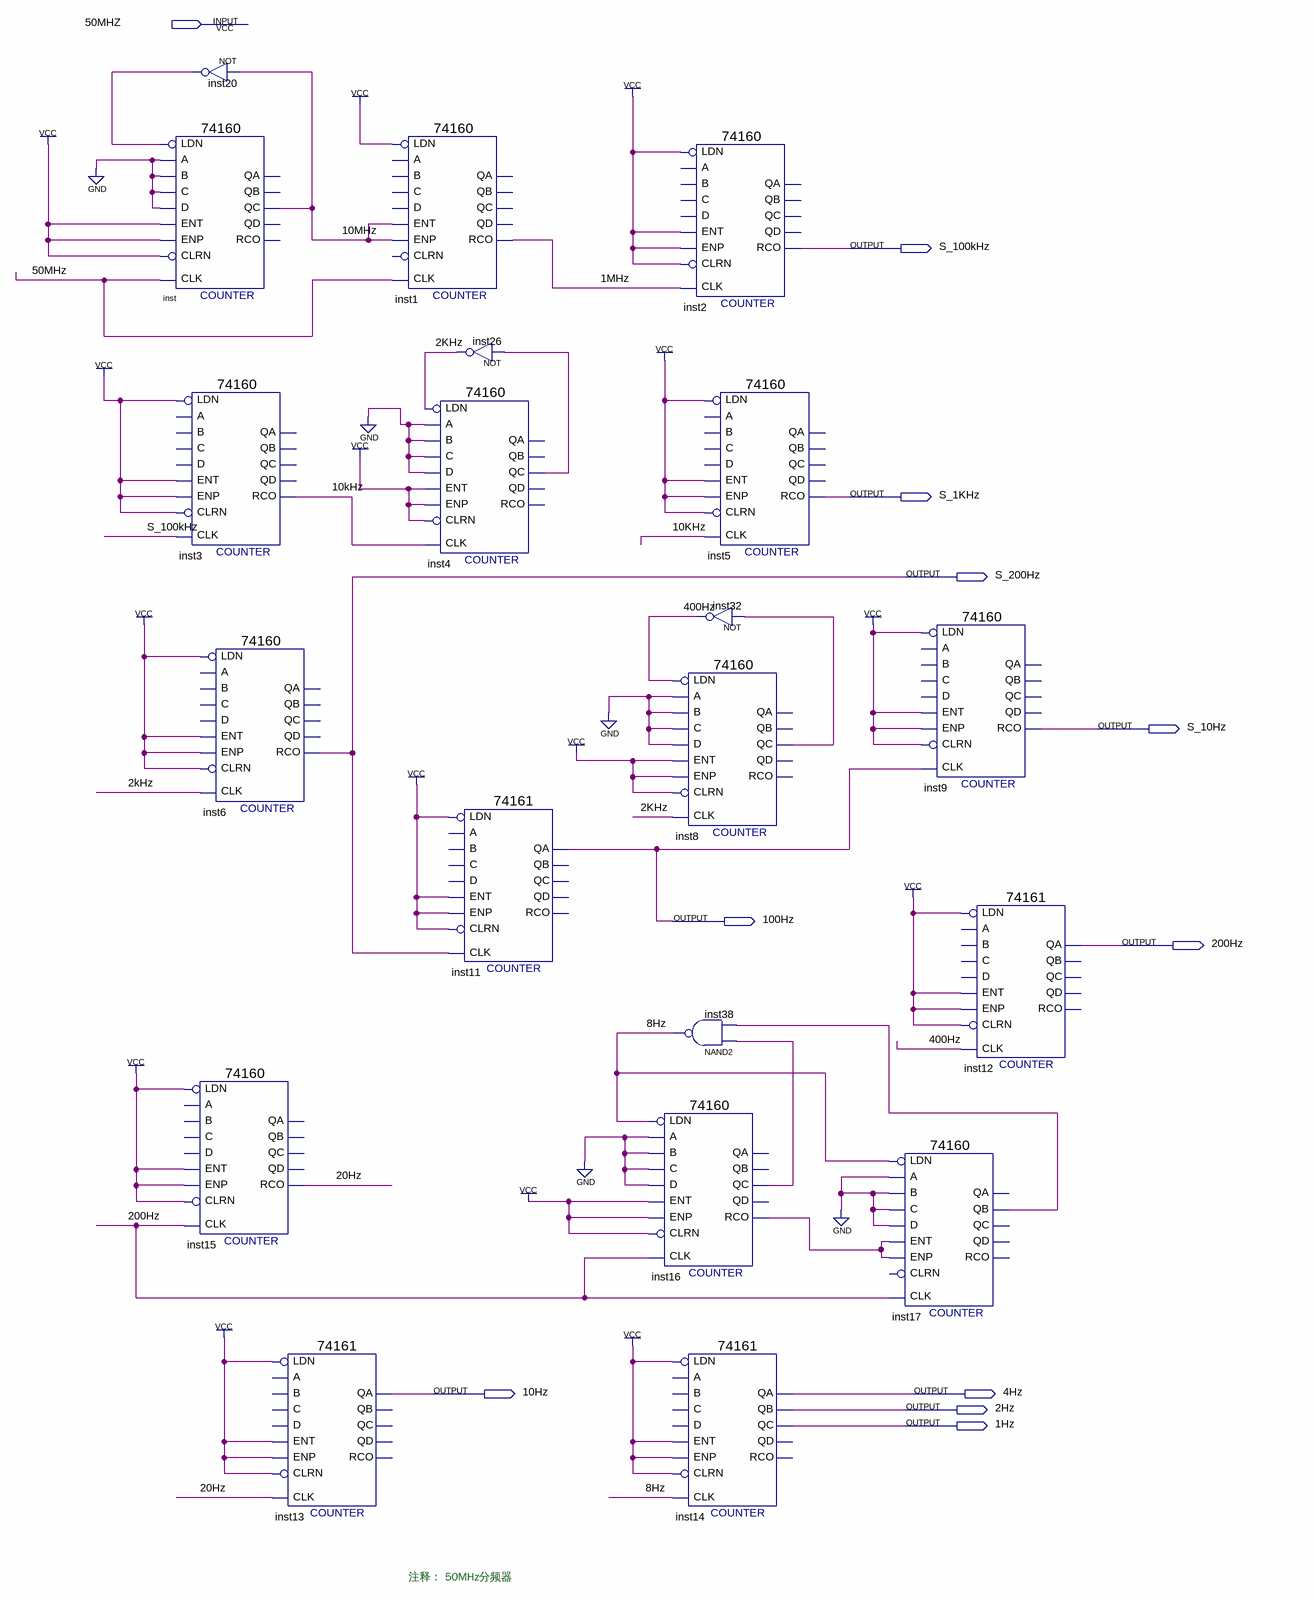
[diagram p0: schematic sheet]
// Quartus schematic FREQ2021_50M.bdf as structural Verilog: 20 symbols, 11 pins
module FREQ2021_50M (
  input  \50MHZ ,
  output S_100kHz,
  output S_1KHz,
  output S_200Hz,
  output S_10Hz,
  output \100Hz ,
  output \200Hz ,
  output \10Hz ,
  output \4Hz ,
  output \2Hz ,
  output \1Hz 
);

  wire \1MHz , \2KHz , \8Hz , \10kHz , \10MHz , \20Hz , \400Hz , inst4_qc, inst8_qc, inst16_qc, inst16_rco,
       inst17_qb, inst20_out;

  not inst20 (inst20_out, \10MHz );
  \74160  inst (
    .CLK(\50MHZ ), .ENT(1'b1), .A(1'b0), .B(1'b0), .C(1'b0), .D(1'b0), .LDN(inst20_out), .ENP(1'b1),
    .CLRN(1'b1), .QC(\10MHz ));  // open: QD, QA, QB, RCO
  \74160  inst3 (
    .CLK(S_100kHz), .ENT(1'b1), .LDN(1'b1), .ENP(1'b1), .CLRN(1'b1), .RCO(\10kHz ));  // open: A, B, C, D, QD, QA, QB, QC
  \74160  inst6 (
    .CLK(\2KHz ), .ENT(1'b1), .LDN(1'b1), .ENP(1'b1), .CLRN(1'b1), .RCO(S_200Hz));  // open: A, B, C, D, QD, QA, QB, QC
  \74160  inst15 (
    .CLK(\200Hz ), .ENT(1'b1), .LDN(1'b1), .ENP(1'b1), .CLRN(1'b1), .RCO(\20Hz ));  // open: A, B, C, D, QD, QA, QB, QC
  \74161  inst13 (
    .CLRN(1'b1), .CLK(\20Hz ), .ENP(1'b1), .LDN(1'b1), .ENT(1'b1), .QA(\10Hz ));  // open: A, D, B, C, QD, QC, QB, RCO
  \74160  inst1 (
    .CLK(\50MHZ ), .ENT(\10MHz ), .LDN(1'b1), .ENP(\10MHz ), .RCO(\1MHz ));  // open: A, B, C, D, CLRN, QD, QA, QB, QC
  not inst26 (\2KHz , inst4_qc);
  \74160  inst4 (
    .CLK(\10kHz ), .ENT(1'b1), .A(1'b0), .B(1'b0), .C(1'b0), .D(1'b0), .LDN(\2KHz ), .ENP(1'b1), .CLRN(1'b1),
    .QC(inst4_qc));  // open: QD, QA, QB, RCO
  \74161  inst11 (
    .CLRN(1'b1), .CLK(S_200Hz), .ENP(1'b1), .LDN(1'b1), .ENT(1'b1), .QA(\100Hz ));  // open: A, D, B, C, QD, QC, QB, RCO
  \74160  inst16 (
    .CLK(\200Hz ), .ENT(1'b1), .A(1'b0), .B(1'b0), .C(1'b0), .D(1'b0), .LDN(\8Hz ), .ENP(1'b1), .CLRN(1'b1),
    .QC(inst16_qc), .RCO(inst16_rco));  // open: QD, QA, QB
  \74160  inst2 (
    .CLK(\1MHz ), .ENT(1'b1), .LDN(1'b1), .ENP(1'b1), .CLRN(1'b1), .RCO(S_100kHz));  // open: A, B, C, D, QD, QA, QB, QC
  \74160  inst5 (
    .CLK(\10kHz ), .ENT(1'b1), .LDN(1'b1), .ENP(1'b1), .CLRN(1'b1), .RCO(S_1KHz));  // open: A, B, C, D, QD, QA, QB, QC
  not inst32 (\400Hz , inst8_qc);
  \74160  inst8 (
    .CLK(\2KHz ), .ENT(1'b1), .A(1'b0), .B(1'b0), .C(1'b0), .D(1'b0), .LDN(\400Hz ), .ENP(1'b1), .CLRN(1'b1),
    .QC(inst8_qc));  // open: QD, QA, QB, RCO
  nand inst38 (\8Hz , inst16_qc, inst17_qb);
  \74161  inst14 (
    .CLRN(1'b1), .CLK(\8Hz ), .ENP(1'b1), .LDN(1'b1), .ENT(1'b1), .QC(\1Hz ), .QB(\2Hz ), .QA(\4Hz ));  // open: A, D, B, C, QD, RCO
  \74160  inst17 (
    .CLK(\200Hz ), .ENT(inst16_rco), .A(1'b0), .B(1'b0), .C(1'b0), .D(1'b0), .LDN(\8Hz ), .ENP(inst16_rco),
    .QB(inst17_qb));  // open: CLRN, QD, QA, QC, RCO
  \74160  inst9 (
    .CLK(\100Hz ), .ENT(1'b1), .LDN(1'b1), .ENP(1'b1), .CLRN(1'b1), .RCO(S_10Hz));  // open: A, B, C, D, QD, QA, QB, QC
  \74161  inst12 (
    .CLRN(1'b1), .CLK(\400Hz ), .ENP(1'b1), .LDN(1'b1), .ENT(1'b1), .QA(\200Hz ));  // open: A, D, B, C, QD, QC, QB, RCO

  // Notes on the sheet:
  //   注释： 50MHz分频器
endmodule
